# EAGLE schematic Schematic_Kelompok12 (EAGLE 7.2.0)
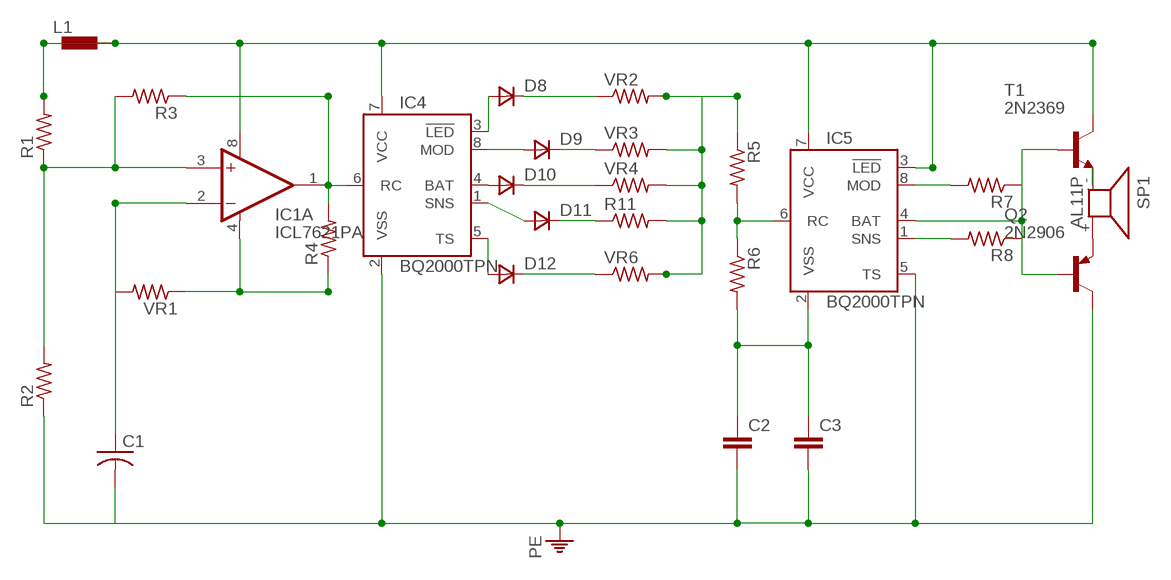
[diagram p0: schematic, sheet 1]

## Parts
C1  C-US025-030X050  [C025-030X050]
C2  C-EU025-030X050  [C025-030X050]
C3  C-EU025-030X050  [C025-030X050]
D8  D_E2L  [E2LINE]
D9  D_E2L  [E2LINE]
D10  D_E2L  [E2LINE]
D11  D_E2L  [E2LINE]
D12  D_E2L  [E2LINE]
IC1  ICL7621PA  [DIL08]
IC4  BQ2000TPN  [DIL08]
IC5  BQ2000TPN  [DIL08]
L1  DR1030  [DR1030]
Q2  2N2906  [TO18]
R1  R-US_0204/7  [0204/7]
R2  R-US_0309/12  [0309/12]
R3  R-US_0309/12  [0309/12]
R4  R-US_0309/12  [0309/12]
R5  R-US_0309/12  [0309/12]
R6  R-US_0309/12  [0309/12]
R7  R-US_0309/12  [0309/12]
R8  R-US_0309/12  [0309/12]
R11  R-US_0204/7  [0204/7]
SP1  AL11P  [AL11P]
T1  2N2369  [TO18]
VR1  R-US_0309/12  [0309/12]
VR2  R-US_0204/7  [0204/7]
VR3  R-US_0204/7  [0204/7]
VR4  R-US_0204/7  [0204/7]
VR6  R-US_0204/7  [0204/7]

## Nets
N$1: IC1.8(A:V+) IC4.7(VCC) IC5.3(!LED) IC5.7(VCC) L1.1 L1.2 R1.2 T1.3(C)
N$2: IC1.3(A:+IN) R1.1 R2.2 R3.2
N$3: IC1.1(A:OUT) IC4.6(RC) R3.1 R4.2
N$4: D9.1(C) VR3.1
N$5: C1.1 IC1.2(A:-IN) VR1.2
N$6: IC1.4(A:V-) R4.1 VR1.1
N$7: IC5.8(MOD) R7.2
N$8: D8.2(A) IC4.3(!LED)
N$9: D9.2(A) IC4.8(MOD)
N$10: D10.2(A) IC4.4(BAT)
N$11: D11.2(A) IC4.1(SNS)
N$12: D12.2(A) IC4.5(TS)
N$13: D11.1(C) R11.1
N$14: Q2.1(E) SP1.+
N$15: D12.1(C) VR6.1
N$16: D10.1(C) VR4.1
N$18: R5.1 R11.2 VR2.2 VR3.2 VR4.2 VR6.2
N$19: IC5.6(RC) R5.2 R6.1
N$20: C2.1 C3.1 IC5.2(VSS) R6.2
N$21: IC5.1(SNS) R8.2
N$22: SP1.- T1.1(E)
N$24: IC5.4(BAT) Q2.2(B) R7.1 R8.1 T1.2(B)
PE: C1.2 C2.2 C3.2 IC4.2(VSS) IC5.5(TS) Q2.3(C) R2.1
VR2: D8.1(C) VR2.1
Unconnected: IC1.5(B:+IN) IC1.6(B:-IN) IC1.7(B:OUT)

## Library data of the parts
C1 = resistor:C-US: CAPACITOR, American symbol
C2 C3 = resistor:C-EU: CAPACITOR, European symbol
D8-D12 = zetex:D_E2L: DIODE; OC_FARNELL: unknown; OC_NEWARK: unknown
IC1 = maxim:ICL7621: Dual Operational Amplifiers Source: http://datasheets.maxim-ic.com/en/ds/ICL7612-ICL764X.pdf; OC_FARNELL: unknown; OC_NEWARK: unknown
IC4 IC5 = texas:BQ2000TPN: CHARGE MANAGEMENT IC; MF: TEXAS INSTRUMENT CONNECTORS; MPN: BQ2000TPN-B5; OC_FARNELL: unknown; OC_NEWARK: 74C7505
L1 = inductors:DR1030: DR1030 Series Low Profile Power Inductors Source: Data sheet <http://www.cooperbussmann.com/pdf/c73e479f-f867-4c64-ae26-9c1f23814163.pdf>
Q2 = transistor-pnp:2N2906*: PNP Transistor
R1-R8 R11 VR1-VR4 VR6 = rcl:R-US_: RESISTOR, American symbol
SP1 = buzzer:AL11P: SPEAKER Source: Buerklin; OC_FARNELL: unknown; OC_NEWARK: unknown
T1 = transistor:2N2369: NPN TRANSISTOR